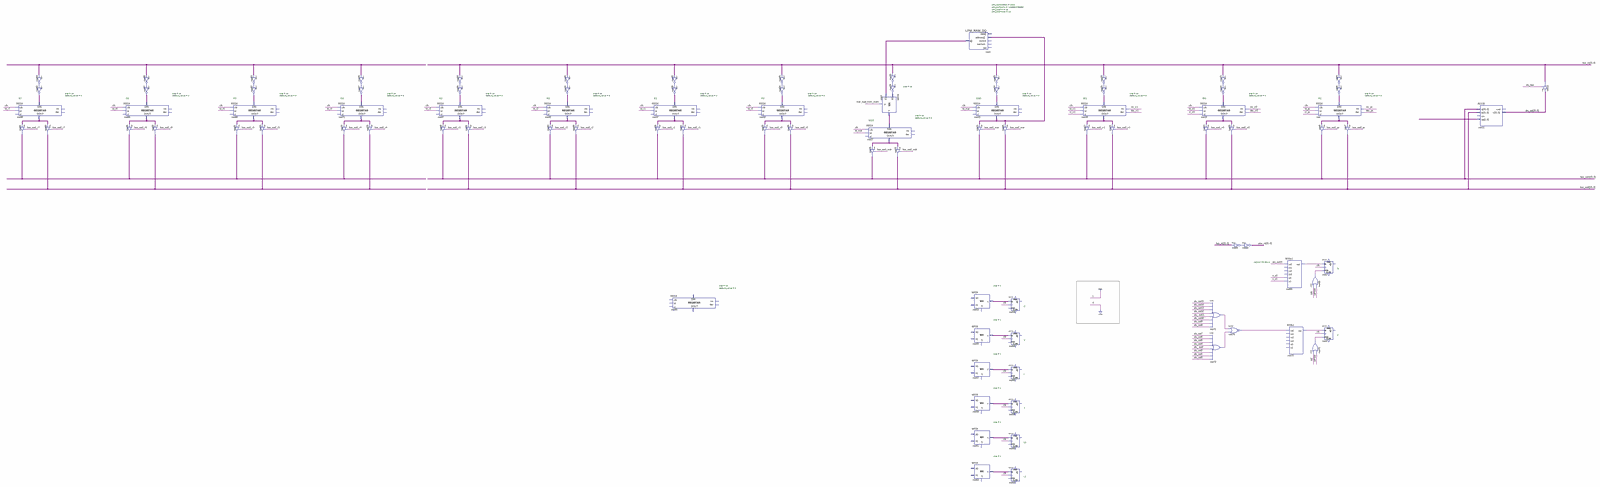
[diagram p0: schematic sheet, whole]
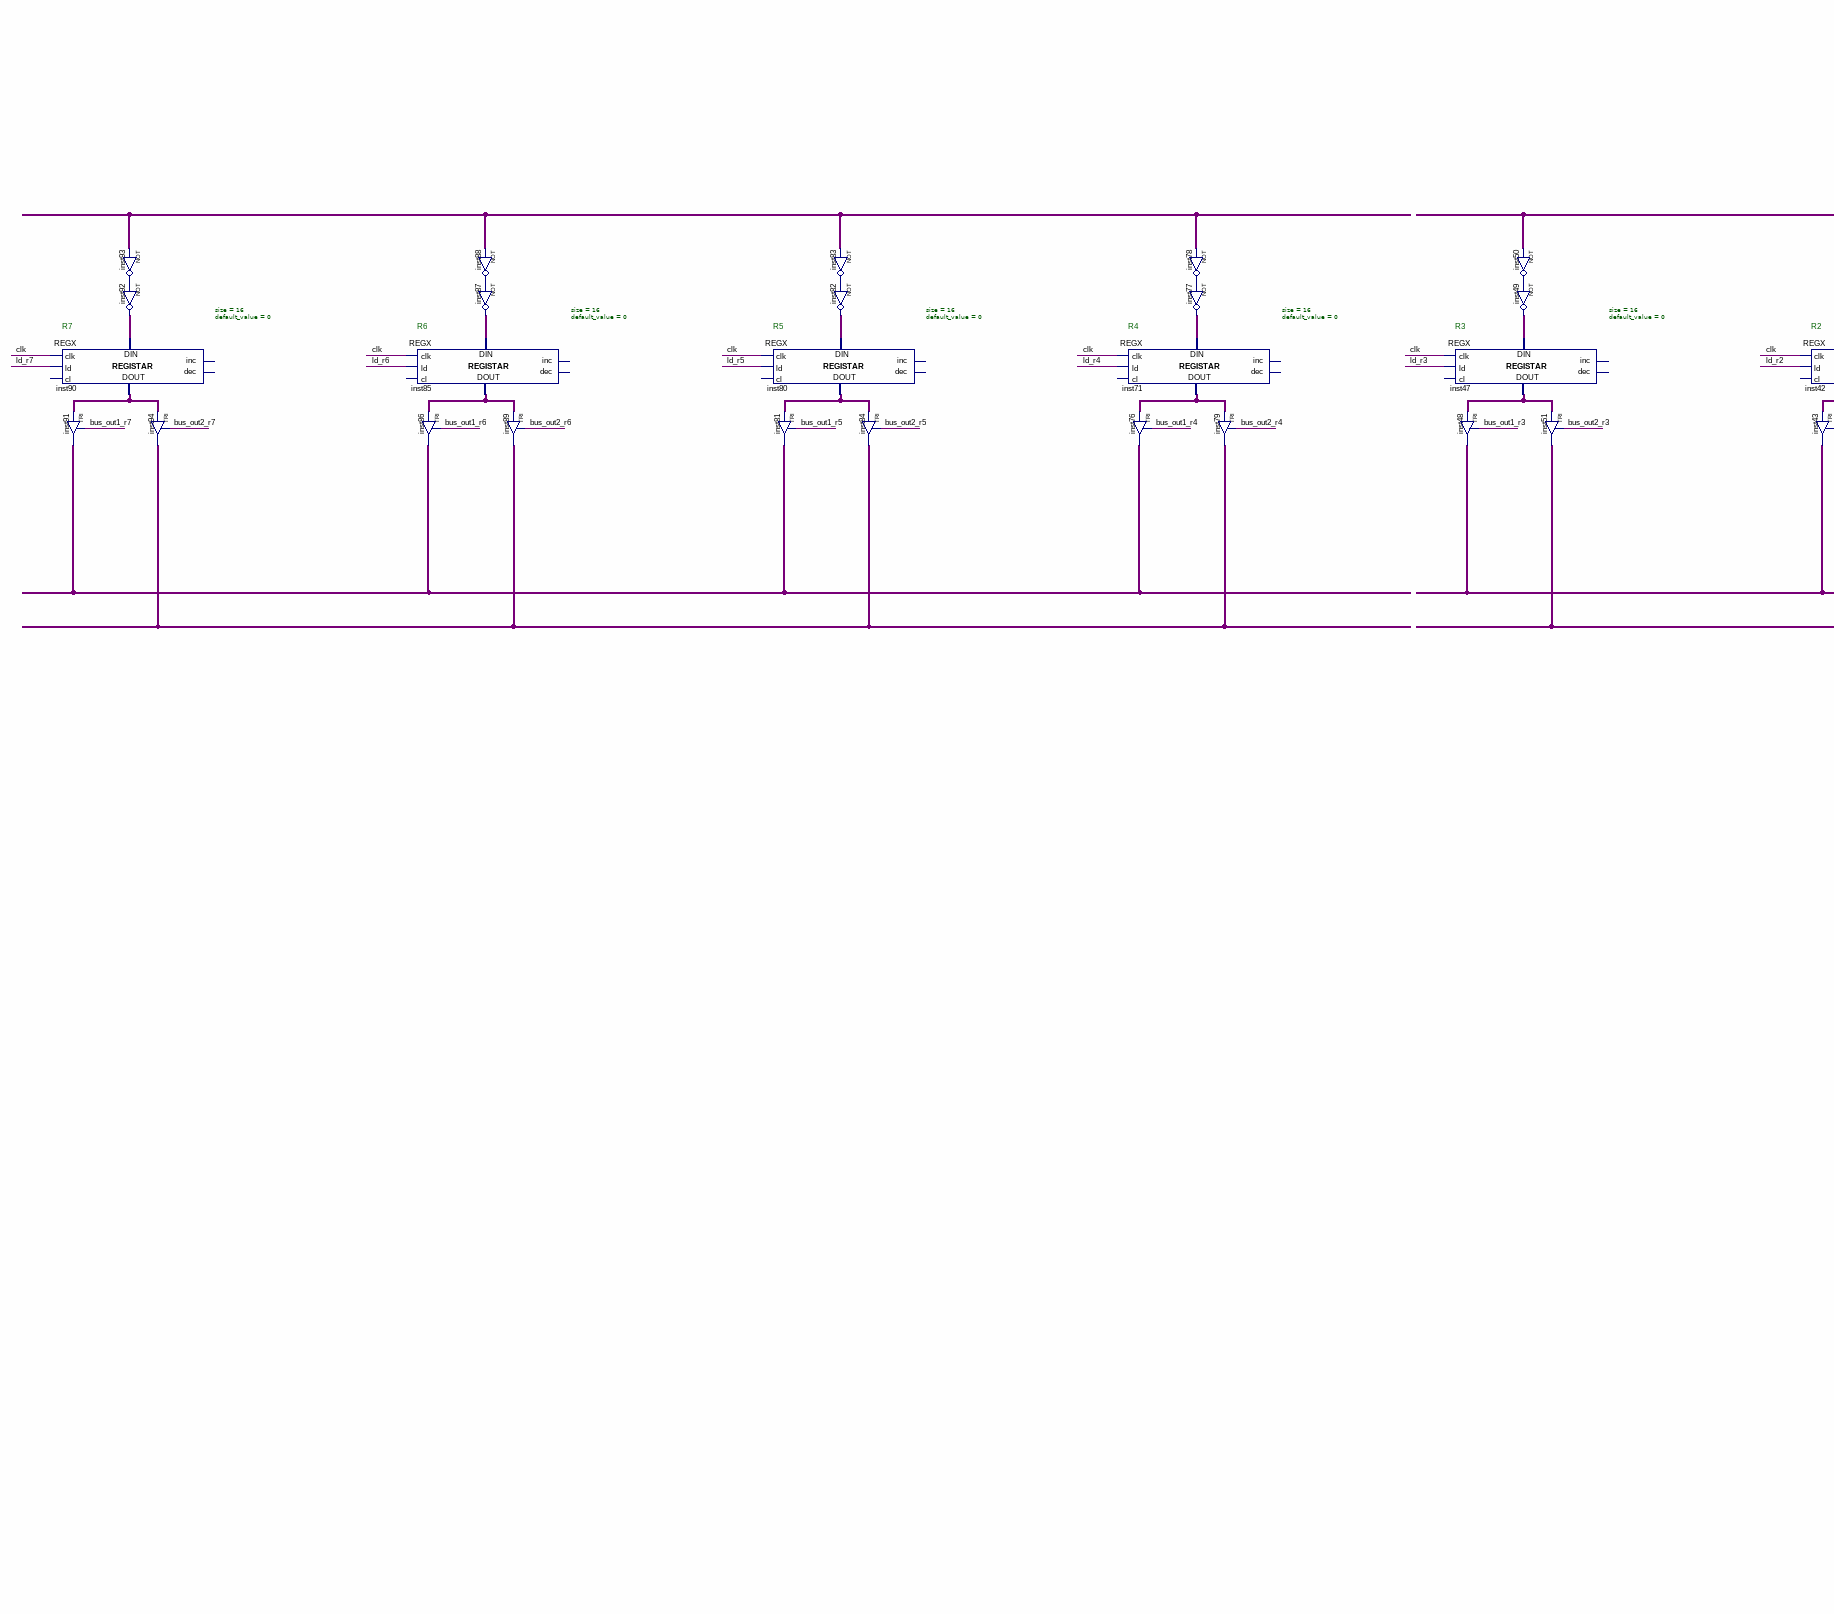
[diagram p1: schematic sheet, left part]
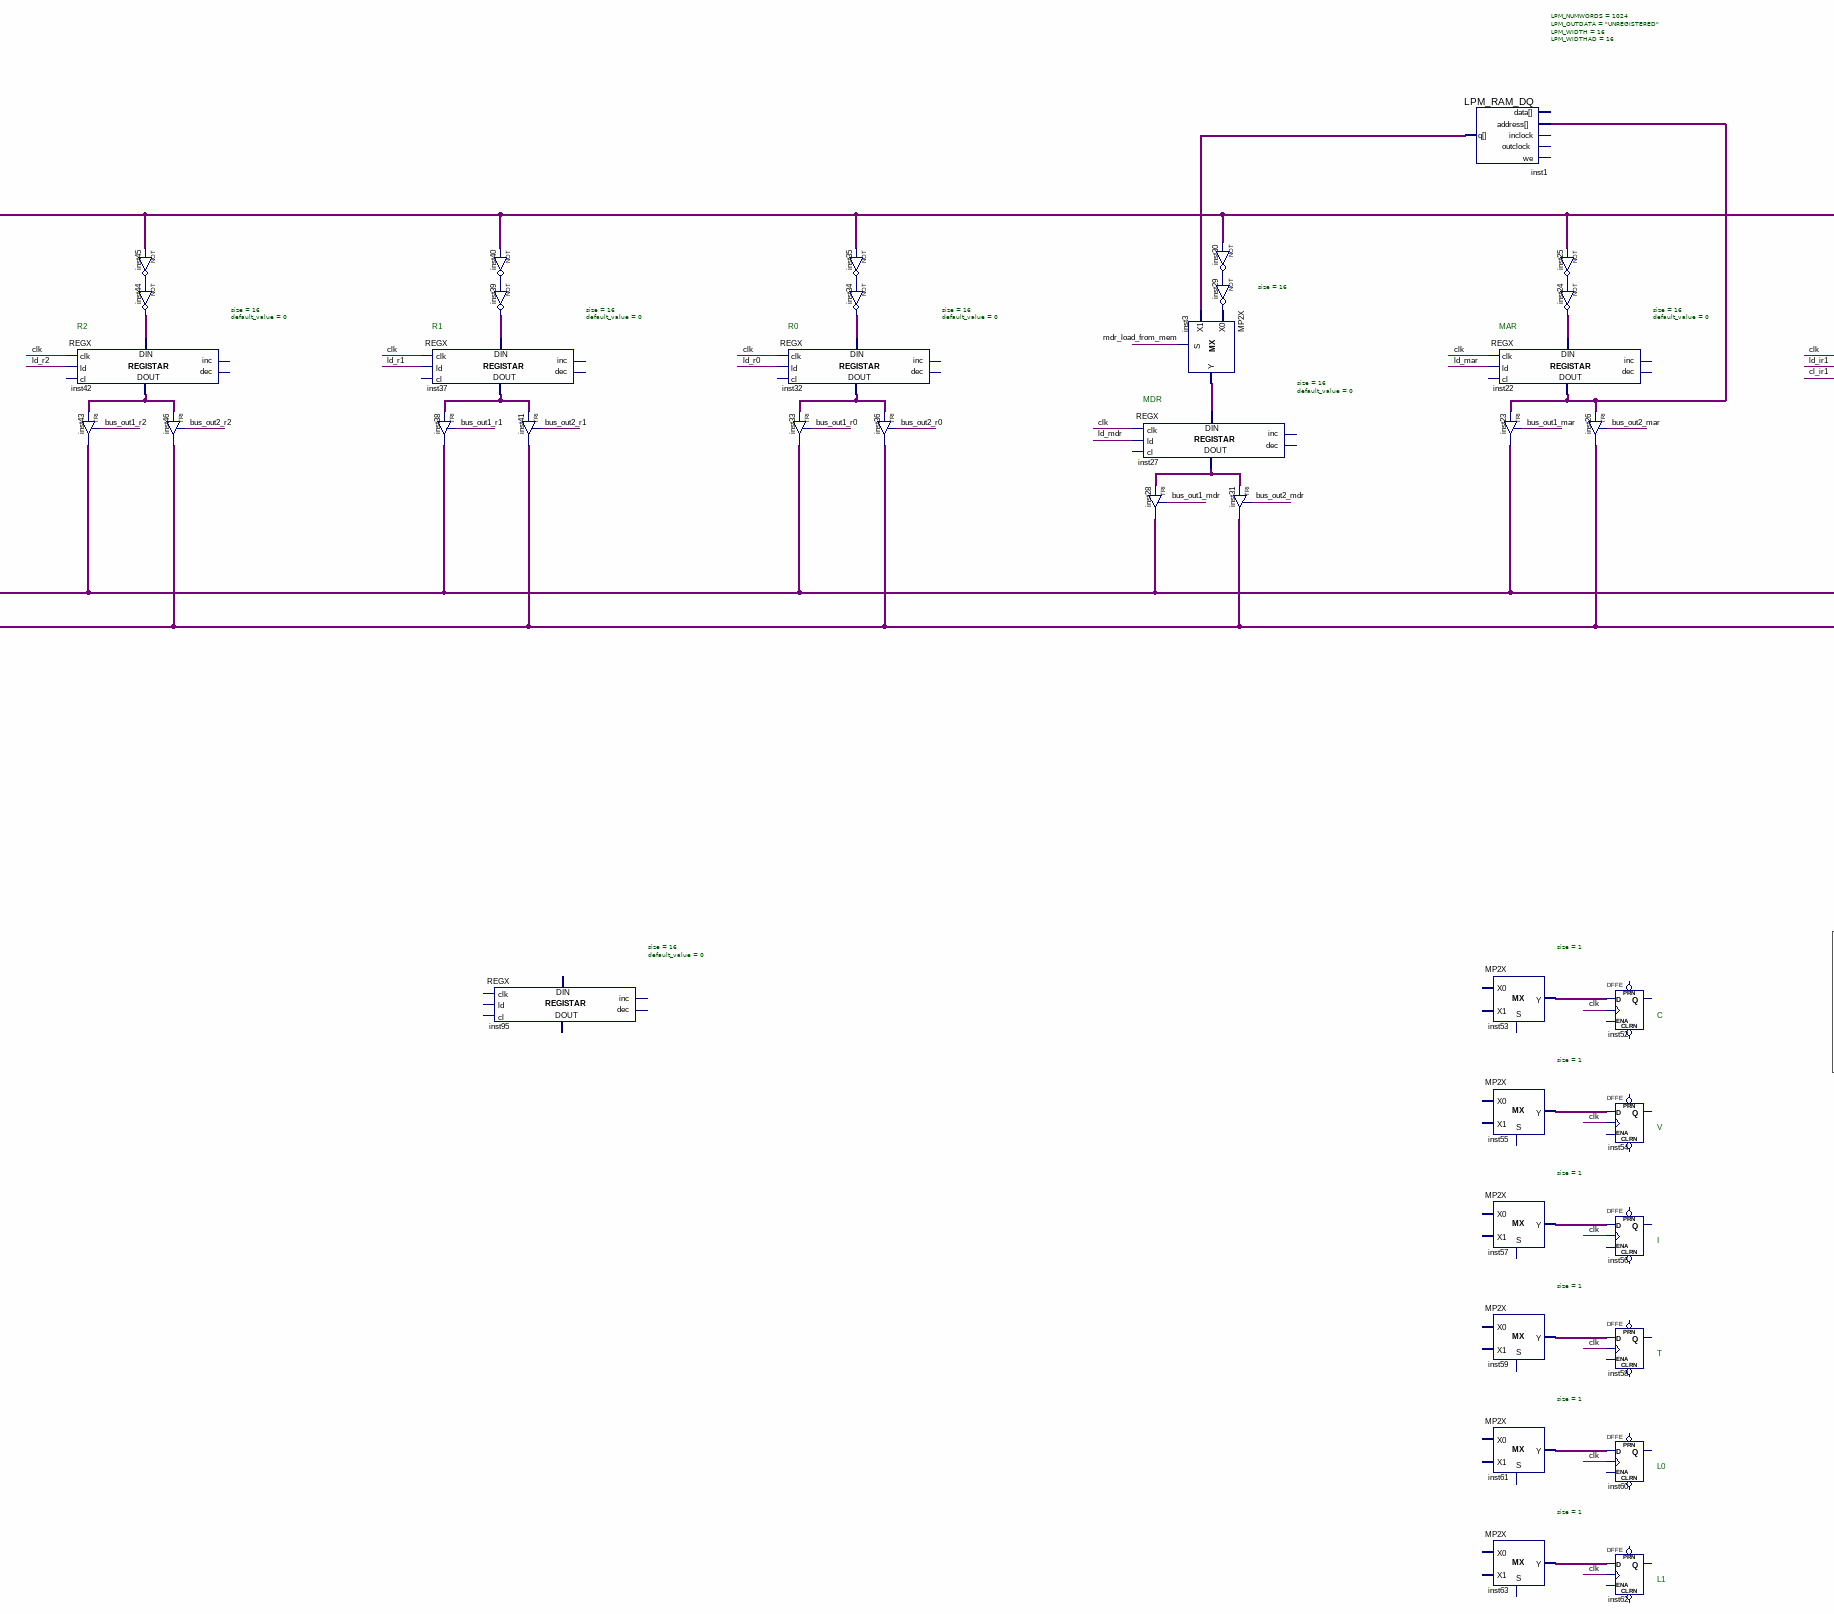
[diagram p2: schematic sheet, centre part]
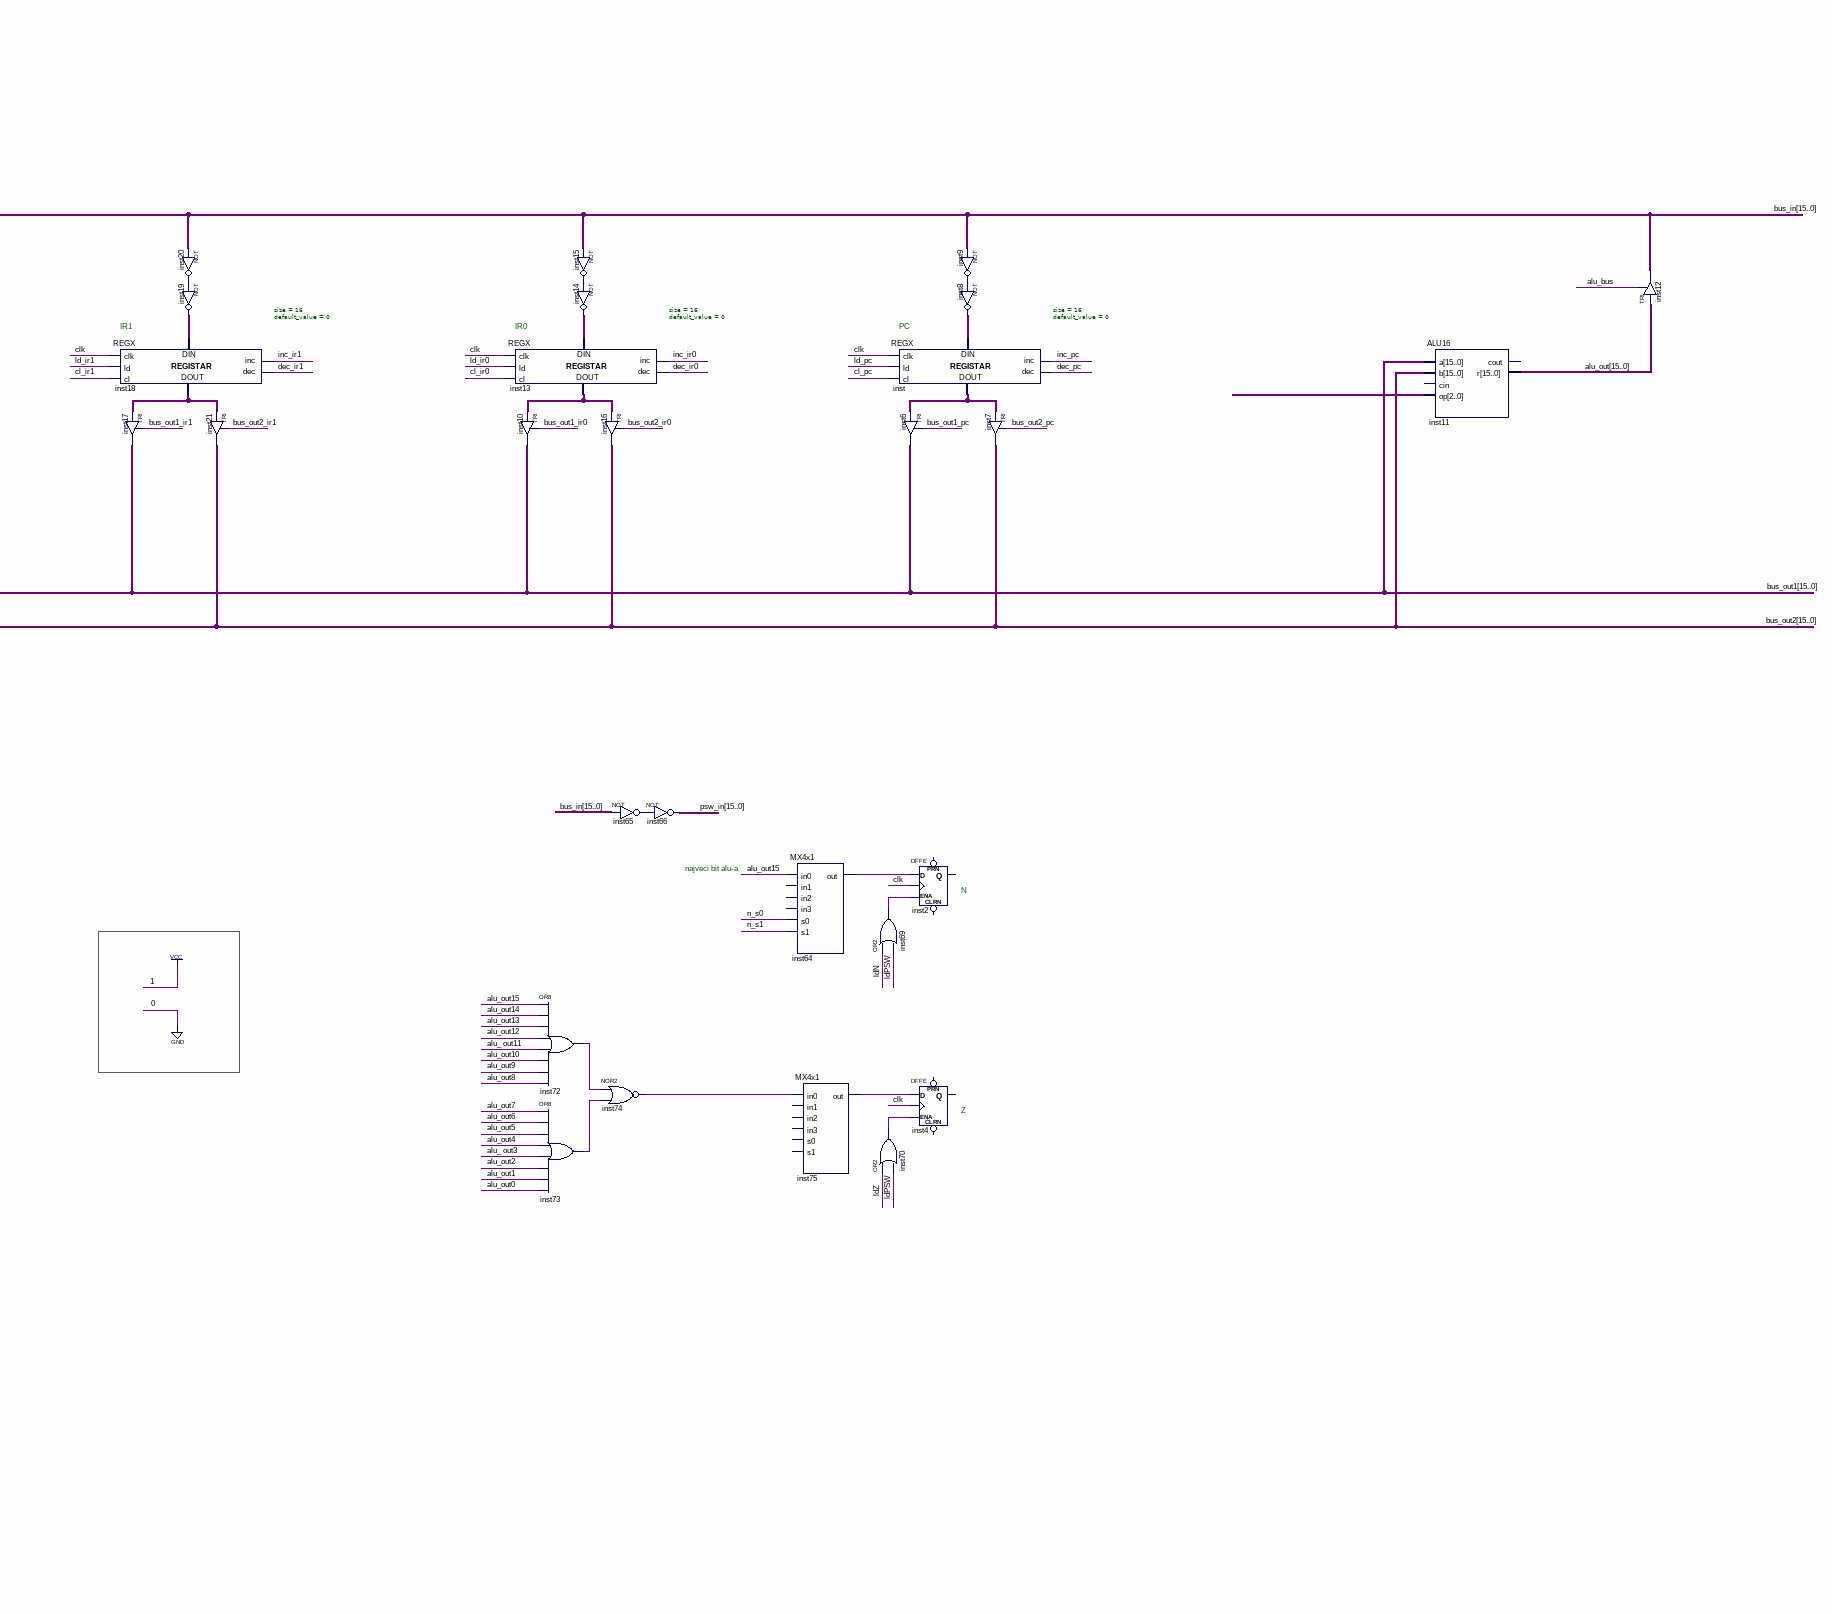
[diagram p3: schematic sheet, right part]
// Quartus schematic cpu.bdf as structural Verilog: 93 symbols, 0 pins
module cpu (
);

  wire \alu__out3 , \alu__out11 , alu_bus, bus_out1_ir0, bus_out1_ir1, bus_out1_mar, bus_out1_mdr,
       bus_out1_pc, bus_out1_r0, bus_out1_r1, bus_out1_r2, bus_out1_r3, bus_out1_r4, bus_out1_r5,
       bus_out1_r6, bus_out1_r7, bus_out2_ir0, bus_out2_ir1, bus_out2_mar, bus_out2_mdr, bus_out2_pc,
       bus_out2_r0, bus_out2_r1, bus_out2_r2, bus_out2_r3, bus_out2_r4, bus_out2_r5, bus_out2_r6,
       bus_out2_r7, cl_ir0, cl_ir1, cl_pc, clk, dec_ir0, dec_ir1, dec_pc, inc_ir0, inc_ir1, inc_pc,
       inst9_out, inst15_out, inst20_out, inst25_out, inst30_out, inst35_out, inst40_out, inst45_out,
       inst50_out, inst53_y, inst55_y, inst57_y, inst59_y, inst61_y, inst63_y, inst64_out, inst65_out,
       inst69_out, inst70_out, inst72_out, inst73_out, inst74_out, inst75_out, inst78_out, inst83_out,
       inst88_out, inst93_out, ld_ir0, ld_ir1, ld_mar, ld_mdr, ld_pc, ld_r0, ld_r1, ld_r2, ld_r3, ld_r4,
       ld_r5, ld_r6, ld_r7, ldN, ldPSW, ldZ, mdr_load_from_mem, n_s0, n_s1, undriven;
  wire [2:0] undriven_2;
  wire [15:0] alu_out, bus_in, bus_out1, bus_out2, inst1_q, inst3_y, inst8_out, inst13_data_out, inst14_out,
       inst18_data_out, inst19_out, inst22_data_out, inst24_out, inst27_data_out, inst29_out,
       inst32_data_out, inst34_out, inst37_data_out, inst39_out, inst42_data_out, inst44_out,
       inst47_data_out, inst49_out, inst71_data_out, inst77_out, inst80_data_out, inst82_out,
       inst85_data_out, inst87_out, inst90_data_out, inst91_out, inst92_out, inst94_out, inst_data_out,
       psw_in;

  REGX #(.size(16), .default_value(0)) inst90 (
    .clk(clk), .ld(ld_r7), .data_in(inst92_out), .data_out(inst90_data_out));  // open: cl, inc, dec
  TRI inst91[15:0] (.IN(inst90_data_out), .OE(bus_out1_r7), .OUT(inst91_out));
  not inst93 (inst93_out, undriven);
  assign inst92_out = ~{16{inst93_out}};  // NOT inst92, 16 bits wide
  TRI inst94[15:0] (.IN(inst90_data_out), .OE(bus_out2_r7), .OUT(inst94_out));
  REGX #(.size(16), .default_value(0)) inst85 (
    .clk(clk), .ld(ld_r6), .data_in(inst87_out), .data_out(inst85_data_out));  // open: cl, inc, dec
  TRI inst86[15:0] (.IN(inst85_data_out), .OE(bus_out1_r6), .OUT(inst91_out));
  not inst88 (inst88_out, undriven);
  assign inst87_out = ~{16{inst88_out}};  // NOT inst87, 16 bits wide
  TRI inst89[15:0] (.IN(inst85_data_out), .OE(bus_out2_r6), .OUT(inst94_out));
  REGX #(.size(16), .default_value(0)) inst80 (
    .clk(clk), .ld(ld_r5), .data_in(inst82_out), .data_out(inst80_data_out));  // open: cl, inc, dec
  TRI inst81[15:0] (.IN(inst80_data_out), .OE(bus_out1_r5), .OUT(inst91_out));
  not inst83 (inst83_out, undriven);
  assign inst82_out = ~{16{inst83_out}};  // NOT inst82, 16 bits wide
  TRI inst84[15:0] (.IN(inst80_data_out), .OE(bus_out2_r5), .OUT(inst94_out));
  REGX #(.size(16), .default_value(0)) inst71 (
    .clk(clk), .ld(ld_r4), .data_in(inst77_out), .data_out(inst71_data_out));  // open: cl, inc, dec
  TRI inst76[15:0] (.IN(inst71_data_out), .OE(bus_out1_r4), .OUT(inst91_out));
  not inst78 (inst78_out, undriven);
  assign inst77_out = ~{16{inst78_out}};  // NOT inst77, 16 bits wide
  TRI inst79[15:0] (.IN(inst71_data_out), .OE(bus_out2_r4), .OUT(inst94_out));
  REGX #(.size(16), .default_value(0)) inst47 (
    .clk(clk), .ld(ld_r3), .data_in(inst49_out), .data_out(inst47_data_out));  // open: cl, inc, dec
  TRI inst48[15:0] (.IN(inst47_data_out), .OE(bus_out1_r3), .OUT(bus_out1));
  assign inst50_out = ~bus_in;  // NOT inst50, 16 bits wide
  assign inst49_out = ~{16{inst50_out}};  // NOT inst49, 16 bits wide
  TRI inst51[15:0] (.IN(inst47_data_out), .OE(bus_out2_r3), .OUT(bus_out2));
  REGX #(.size(16), .default_value(0)) inst42 (
    .clk(clk), .ld(ld_r2), .data_in(inst44_out), .data_out(inst42_data_out));  // open: cl, inc, dec
  TRI inst43[15:0] (.IN(inst42_data_out), .OE(bus_out1_r2), .OUT(bus_out1));
  assign inst45_out = ~bus_in;  // NOT inst45, 16 bits wide
  assign inst44_out = ~{16{inst45_out}};  // NOT inst44, 16 bits wide
  TRI inst46[15:0] (.IN(inst42_data_out), .OE(bus_out2_r2), .OUT(bus_out2));
  REGX #(.size(16), .default_value(0)) inst37 (
    .clk(clk), .ld(ld_r1), .data_in(inst39_out), .data_out(inst37_data_out));  // open: cl, inc, dec
  TRI inst38[15:0] (.IN(inst37_data_out), .OE(bus_out1_r1), .OUT(bus_out1));
  assign inst40_out = ~bus_in;  // NOT inst40, 16 bits wide
  assign inst39_out = ~{16{inst40_out}};  // NOT inst39, 16 bits wide
  REGX #(.size(16), .default_value(0)) inst95 ();  // open: clk, ld, cl, inc, dec, data_in, data_out
  TRI inst41[15:0] (.IN(inst37_data_out), .OE(bus_out2_r1), .OUT(bus_out2));
  REGX #(.size(16), .default_value(0)) inst32 (
    .clk(clk), .ld(ld_r0), .data_in(inst34_out), .data_out(inst32_data_out));  // open: cl, inc, dec
  TRI inst33[15:0] (.IN(inst32_data_out), .OE(bus_out1_r0), .OUT(bus_out1));
  assign inst35_out = ~bus_in;  // NOT inst35, 16 bits wide
  assign inst34_out = ~{16{inst35_out}};  // NOT inst34, 16 bits wide
  TRI inst36[15:0] (.IN(inst32_data_out), .OE(bus_out2_r0), .OUT(bus_out2));
  REGX #(.size(16), .default_value(0)) inst27 (
    .clk(clk), .ld(ld_mdr), .data_in(inst3_y), .data_out(inst27_data_out));  // open: cl, inc, dec
  TRI inst28[15:0] (.IN(inst27_data_out), .OE(bus_out1_mdr), .OUT(bus_out1));
  assign inst30_out = ~bus_in;  // NOT inst30, 16 bits wide
  assign inst29_out = ~{16{inst30_out}};  // NOT inst29, 16 bits wide
  MP2X #(.size(16)) inst3 (.S(mdr_load_from_mem), .X0(inst29_out), .X1(inst1_q), .Y(inst3_y));
  TRI inst31[15:0] (.IN(inst27_data_out), .OE(bus_out2_mdr), .OUT(bus_out2));
  LPM_RAM_DQ #(.LPM_NUMWORDS(1024), .LPM_OUTDATA("UNREGISTERED"), .LPM_WIDTH(16), .LPM_WIDTHAD(16)) inst1 (
    .address(inst22_data_out), .q(inst1_q));  // open: inclock, data, we, outclock
  MP2X #(.size(1)) inst53 (.Y(inst53_y));  // open: S, X0, X1
  MP2X #(.size(1)) inst55 (.Y(inst55_y));  // open: S, X0, X1
  MP2X #(.size(1)) inst57 (.Y(inst57_y));  // open: S, X0, X1
  MP2X #(.size(1)) inst59 (.Y(inst59_y));  // open: S, X0, X1
  MP2X #(.size(1)) inst61 (.Y(inst61_y));  // open: S, X0, X1
  MP2X #(.size(1)) inst63 (.Y(inst63_y));  // open: S, X0, X1
  REGX #(.size(16), .default_value(0)) inst22 (
    .clk(clk), .ld(ld_mar), .data_in(inst24_out), .data_out(inst22_data_out));  // open: cl, inc, dec
  TRI inst23[15:0] (.IN(inst22_data_out), .OE(bus_out1_mar), .OUT(bus_out1));
  assign inst25_out = ~bus_in;  // NOT inst25, 16 bits wide
  assign inst24_out = ~{16{inst25_out}};  // NOT inst24, 16 bits wide
  TRI inst26[15:0] (.IN(inst22_data_out), .OE(bus_out2_mar), .OUT(bus_out2));
  DFFE inst52 (.D(inst53_y), .CLK(clk));  // open: PRN, CLRN, ENA, Q
  DFFE inst54 (.D(inst55_y), .CLK(clk));  // open: PRN, CLRN, ENA, Q
  DFFE inst56 (.D(inst57_y), .CLK(clk));  // open: PRN, CLRN, ENA, Q
  DFFE inst58 (.D(inst59_y), .CLK(clk));  // open: PRN, CLRN, ENA, Q
  DFFE inst60 (.D(inst61_y), .CLK(clk));  // open: PRN, CLRN, ENA, Q
  DFFE inst62 (.D(inst63_y), .CLK(clk));  // open: PRN, CLRN, ENA, Q
  REGX #(.size(16), .default_value(0)) inst18 (
    .clk(clk), .ld(ld_ir1), .cl(cl_ir1), .inc(inc_ir1), .dec(dec_ir1), .data_in(inst19_out),
    .data_out(inst18_data_out));
  TRI inst17[15:0] (.IN(inst18_data_out), .OE(bus_out1_ir1), .OUT(bus_out1));
  assign inst20_out = ~bus_in;  // NOT inst20, 16 bits wide
  assign inst19_out = ~{16{inst20_out}};  // NOT inst19, 16 bits wide
  TRI inst21[15:0] (.IN(inst18_data_out), .OE(bus_out2_ir1), .OUT(bus_out2));
  REGX #(.size(16), .default_value(0)) inst13 (
    .clk(clk), .ld(ld_ir0), .cl(cl_ir0), .inc(inc_ir0), .dec(dec_ir0), .data_in(inst14_out),
    .data_out(inst13_data_out));
  TRI inst10[15:0] (.IN(inst13_data_out), .OE(bus_out1_ir0), .OUT(bus_out1));
  or inst72 (inst72_out, alu_out[15], alu_out[14], alu_out[13], alu_out[12], \alu__out11 , alu_out[10], alu_out[9], alu_out[8]);
  or inst73 (inst73_out, alu_out[7], alu_out[6], alu_out[5], alu_out[4], \alu__out3 , alu_out[2], alu_out[1], alu_out[0]);
  assign inst15_out = ~bus_in;  // NOT inst15, 16 bits wide
  assign inst14_out = ~{16{inst15_out}};  // NOT inst14, 16 bits wide
  TRI inst16[15:0] (.IN(inst13_data_out), .OE(bus_out2_ir0), .OUT(bus_out2));
  nor inst74 (inst74_out, inst72_out, inst73_out);
  assign inst65_out = ~bus_in;  // NOT inst65, 16 bits wide
  assign psw_in = ~{16{inst65_out}};  // NOT inst66, 16 bits wide
  MX4x1 inst64 (.in0(alu_out[15]), .s0(n_s0), .s1(n_s1), .out(inst64_out));  // open: in1, in2, in3
  MX4x1 inst75 (.in0(inst74_out), .out(inst75_out));  // open: in1, in2, in3, s0, s1
  or inst69 (inst69_out, ldN, ldPSW);
  or inst70 (inst70_out, ldZ, ldPSW);
  REGX #(.size(16), .default_value(0)) inst (
    .clk(clk), .ld(ld_pc), .cl(cl_pc), .inc(inc_pc), .dec(dec_pc), .data_in(inst8_out),
    .data_out(inst_data_out));
  TRI inst6[15:0] (.IN(inst_data_out), .OE(bus_out1_pc), .OUT(bus_out1));
  DFFE inst2 (.D(inst64_out), .CLK(clk), .ENA(inst69_out));  // open: PRN, CLRN, Q
  DFFE inst4 (.D(inst75_out), .CLK(clk), .ENA(inst70_out));  // open: PRN, CLRN, Q
  assign inst9_out = ~bus_in;  // NOT inst9, 16 bits wide
  assign inst8_out = ~{16{inst9_out}};  // NOT inst8, 16 bits wide
  TRI inst7[15:0] (.IN(inst_data_out), .OE(bus_out2_pc), .OUT(bus_out2));
  ALU16 inst11 (.a(bus_out1), .b(bus_out2), .op(undriven_2), .r(alu_out));  // open: cin, cout
  TRI inst12[15:0] (.IN(alu_out), .OE(alu_bus), .OUT(bus_in));

  // Notes on the sheet:
  //   R7
  //   R6
  //   R5
  //   R4
  //   R3
  //   R2
  //   R1
  //   R0
  //   MAR
  //   IR1
  //   IR0
  //   PC
  //   MDR
  //   najveci bit alu-a
  //   N
  //   C
  //   Z
  //   V
  //   I
  //   T
  //   L0
  //   L1
endmodule
